# EAGLE schematic magnetov1 (EAGLE 9.1.0)
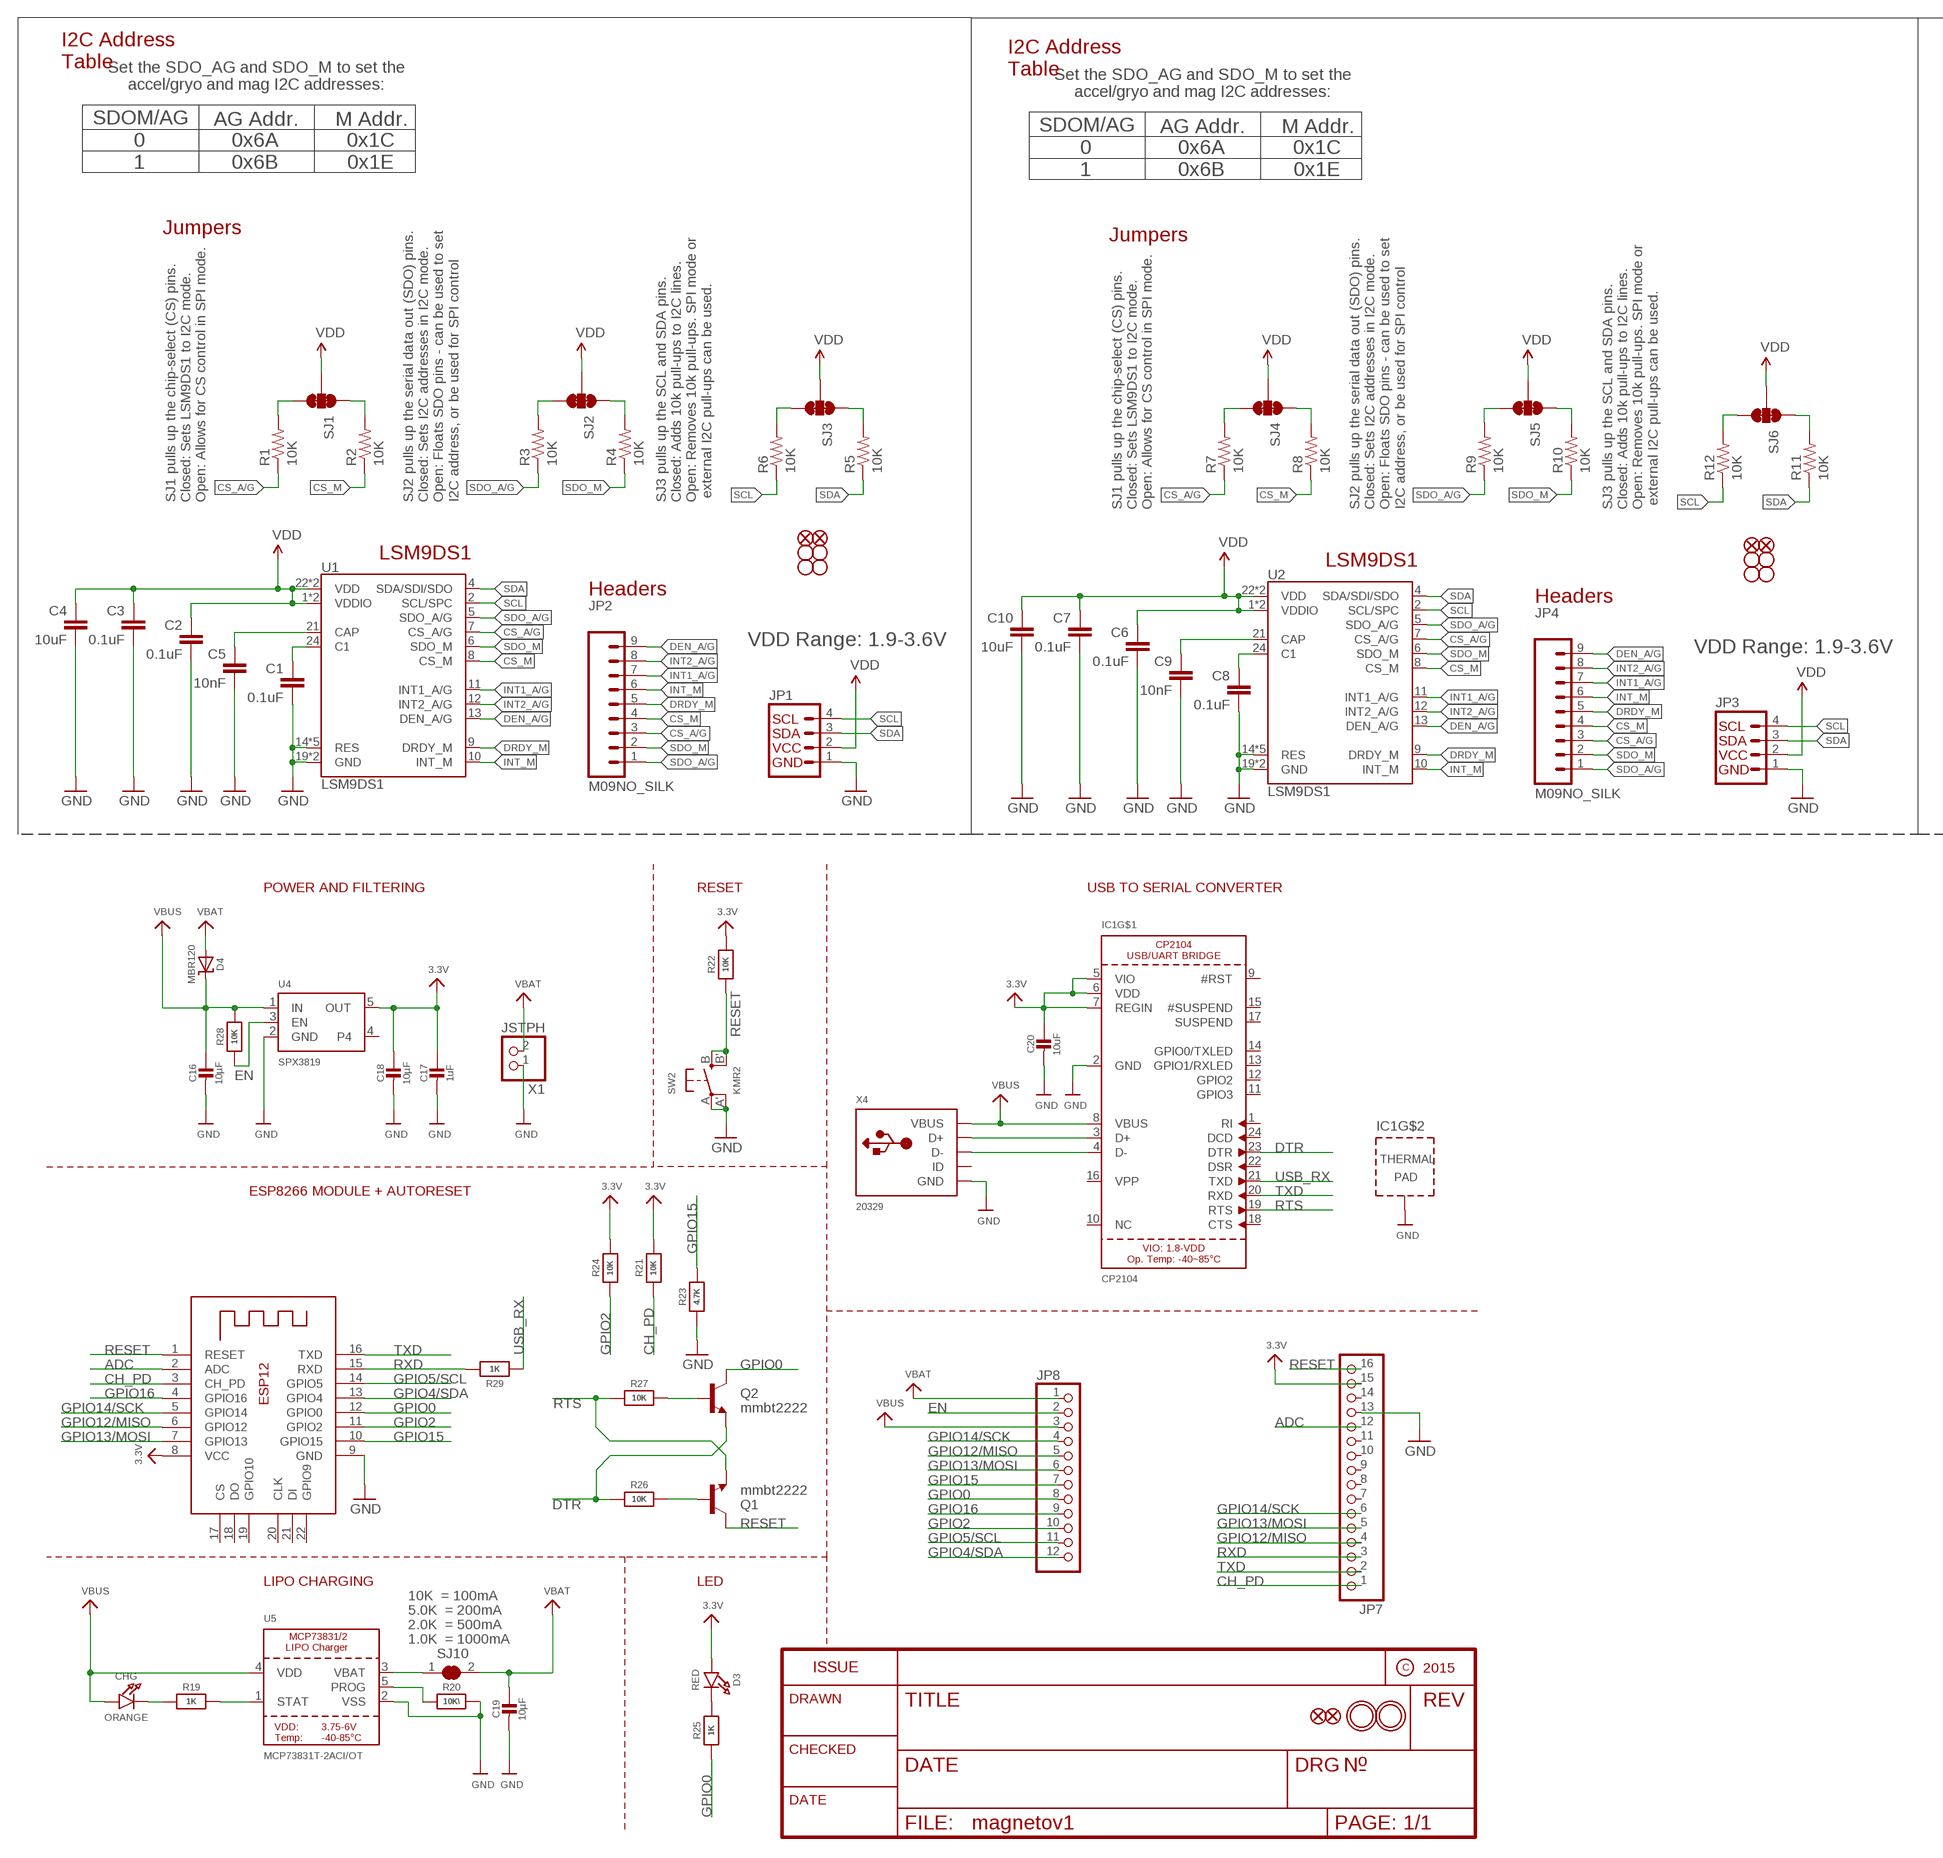
[diagram p0: schematic, sheet 1, part 1 of 2]
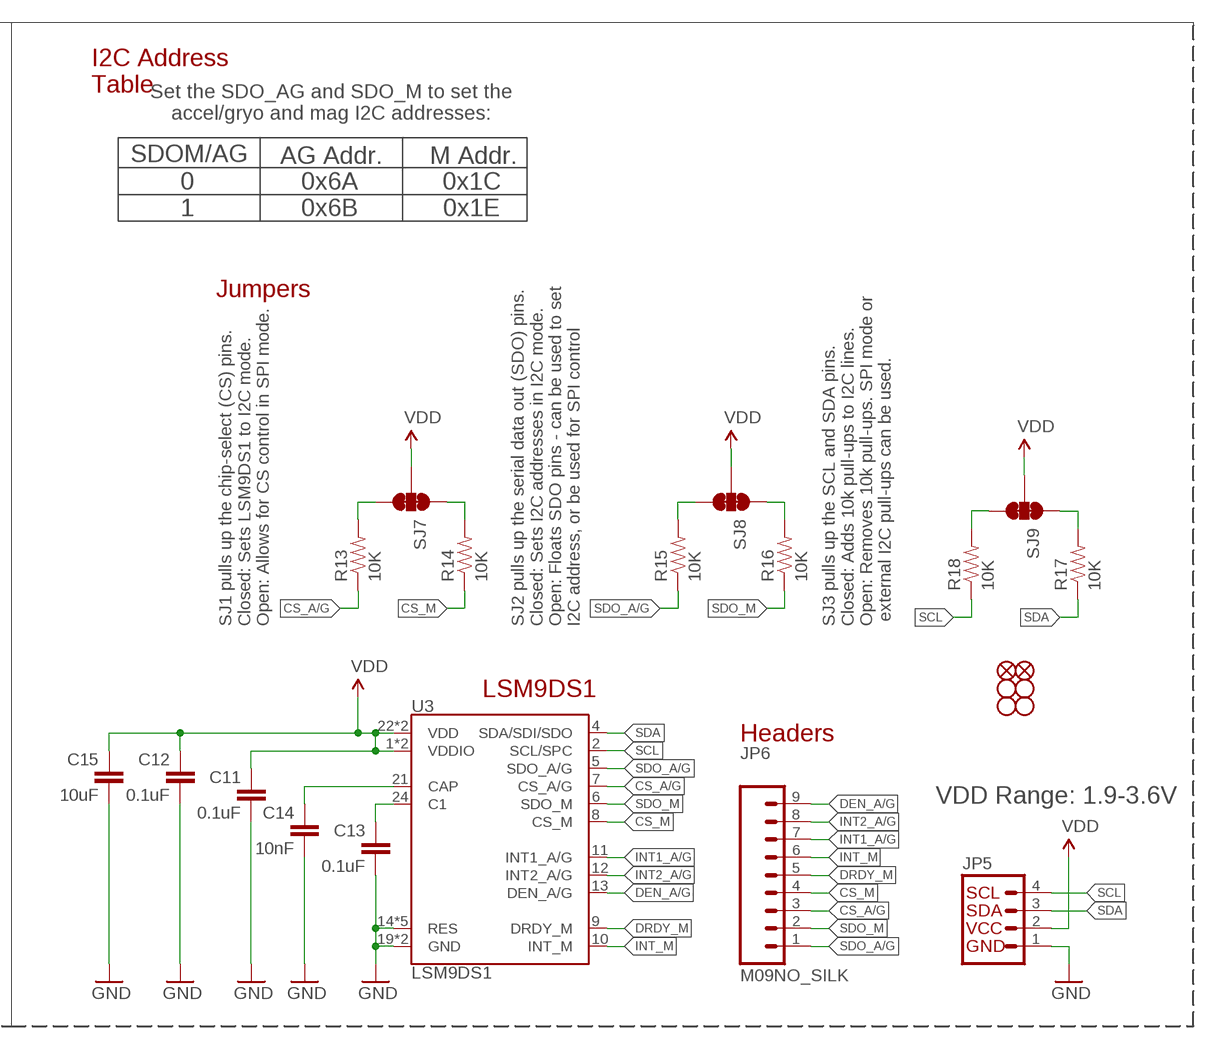
[diagram p1: schematic, sheet 1, part 2 of 2]

## Parts
C1  0.1uF  0.1UF-25V(+80/-20%)(0603)  [0603-CAP]
C2  0.1uF  0.1UF-25V(+80/-20%)(0603)  [0603-CAP]
C3  0.1uF  0.1UF-25V(+80/-20%)(0603)  [0603-CAP]
C4  10uF  10UF-6.3V-20%(0603)  [0603-CAP]
C5  10nF  10NF/10000PF-50V-10%(0603)  [0603-CAP]
C6  0.1uF  0.1UF-25V(+80/-20%)(0603)  [0603-CAP]
C7  0.1uF  0.1UF-25V(+80/-20%)(0603)  [0603-CAP]
C8  0.1uF  0.1UF-25V(+80/-20%)(0603)  [0603-CAP]
C9  10nF  10NF/10000PF-50V-10%(0603)  [0603-CAP]
C10  10uF  10UF-6.3V-20%(0603)  [0603-CAP]
C11  0.1uF  0.1UF-25V(+80/-20%)(0603)  [0603-CAP]
C12  0.1uF  0.1UF-25V(+80/-20%)(0603)  [0603-CAP]
C13  0.1uF  0.1UF-25V(+80/-20%)(0603)  [0603-CAP]
C14  10nF  10NF/10000PF-50V-10%(0603)  [0603-CAP]
C15  10uF  10UF-6.3V-20%(0603)  [0603-CAP]
C16  10µF  CAP_CERAMIC0805-NOOUTLINE  [0805-NO]
C17  1uF  CAP_CERAMIC0603_NO  [0603-NO]
C18  10µF  CAP_CERAMIC0805-NOOUTLINE  [0805-NO]
C19  10µF  CAP_CERAMIC0805-NOOUTLINE  [0805-NO]
C20  10uF  CAP_CERAMIC0805-NOOUTLINE  [0805-NO]
CHG  ORANGE  LED0805_NOOUTLINE  [CHIPLED_0805_NOOUTLINE]
D3  RED  LED0805_NOOUTLINE  [CHIPLED_0805_NOOUTLINE]
D4  MBR120  DIODE-SCHOTTKYSOD-123  [SOD-123]
FID1  FIDUCIAL1X2  [FIDUCIAL-1X2]
FID2  FIDUCIAL1X2  [FIDUCIAL-1X2]
FID3  FIDUCIAL1X2  [FIDUCIAL-1X2]
FID4  FIDUCIAL1X2  [FIDUCIAL-1X2]
FID5  FIDUCIAL1X2  [FIDUCIAL-1X2]
FID6  FIDUCIAL1X2  [FIDUCIAL-1X2]
IC1  CP2104  [QFN24_4MM_SMSC]
JP1  I2C_STANDARD_NO_SILK  [1X04_NO_SILK]
JP2  M09NO_SILK  [1X09_NO_SILK]
JP3  I2C_STANDARD_NO_SILK  [1X04_NO_SILK]
JP4  M09NO_SILK  [1X09_NO_SILK]
JP5  I2C_STANDARD_NO_SILK  [1X04_NO_SILK]
JP6  M09NO_SILK  [1X09_NO_SILK]
JP7  HEADER-1X16ROUND  [1X16_ROUND]
JP8  HEADER-1X12  [1X12_ROUND]
Q1  mmbt2222  TRANSISTOR_NPNSOT23-3  [SOT23-3]
Q2  mmbt2222  TRANSISTOR_NPNSOT23-3  [SOT23-3]
R1  10K  10KOHM-1/10W-1%(0603)0603  [0603-RES]
R2  10K  10KOHM-1/10W-1%(0603)0603  [0603-RES]
R3  10K  10KOHM-1/10W-1%(0603)0603  [0603-RES]
R4  10K  10KOHM-1/10W-1%(0603)0603  [0603-RES]
R5  10K  10KOHM-1/10W-1%(0603)0603  [0603-RES]
R6  10K  10KOHM-1/10W-1%(0603)0603  [0603-RES]
R7  10K  10KOHM-1/10W-1%(0603)0603  [0603-RES]
R8  10K  10KOHM-1/10W-1%(0603)0603  [0603-RES]
R9  10K  10KOHM-1/10W-1%(0603)0603  [0603-RES]
R10  10K  10KOHM-1/10W-1%(0603)0603  [0603-RES]
R11  10K  10KOHM-1/10W-1%(0603)0603  [0603-RES]
R12  10K  10KOHM-1/10W-1%(0603)0603  [0603-RES]
R13  10K  10KOHM-1/10W-1%(0603)0603  [0603-RES]
R14  10K  10KOHM-1/10W-1%(0603)0603  [0603-RES]
R15  10K  10KOHM-1/10W-1%(0603)0603  [0603-RES]
R16  10K  10KOHM-1/10W-1%(0603)0603  [0603-RES]
R17  10K  10KOHM-1/10W-1%(0603)0603  [0603-RES]
R18  10K  10KOHM-1/10W-1%(0603)0603  [0603-RES]
R19  1K  RESISTOR_0603_NOOUT  [0603-NO]
R20  10K\  RESISTOR_0603_NOOUT  [0603-NO]
R21  10K  RESISTOR_0603_NOOUT  [0603-NO]
R22  10K  RESISTOR_0603_NOOUT  [0603-NO]
R23  4.7K  RESISTOR_0603_NOOUT  [0603-NO]
R24  10K  RESISTOR_0603_NOOUT  [0603-NO]
R25  1K  RESISTOR_0603_NOOUT  [0603-NO]
R26  10K  RESISTOR_0603_NOOUT  [0603-NO]
R27  10K  RESISTOR_0603MP  [_0603MP]
R28  10K  RESISTOR_0603_NOOUT  [0603-NO]
R29  1K  RESISTOR_0603MP  [_0603MP]
SJ1  JUMPER-PAD-3-NC_BY_TRACE  [PAD-JUMPER-3-3OF3_NC_BY_TRACE_YES_SILK_FULL_BOX]
SJ2  JUMPER-PAD-3-NC_BY_TRACE  [PAD-JUMPER-3-3OF3_NC_BY_TRACE_YES_SILK_FULL_BOX]
SJ3  JUMPER-PAD-3-NC_BY_TRACE  [PAD-JUMPER-3-3OF3_NC_BY_TRACE_YES_SILK_FULL_BOX]
SJ4  JUMPER-PAD-3-NC_BY_TRACE  [PAD-JUMPER-3-3OF3_NC_BY_TRACE_YES_SILK_FULL_BOX]
SJ5  JUMPER-PAD-3-NC_BY_TRACE  [PAD-JUMPER-3-3OF3_NC_BY_TRACE_YES_SILK_FULL_BOX]
SJ6  JUMPER-PAD-3-NC_BY_TRACE  [PAD-JUMPER-3-3OF3_NC_BY_TRACE_YES_SILK_FULL_BOX]
SJ7  JUMPER-PAD-3-NC_BY_TRACE  [PAD-JUMPER-3-3OF3_NC_BY_TRACE_YES_SILK_FULL_BOX]
SJ8  JUMPER-PAD-3-NC_BY_TRACE  [PAD-JUMPER-3-3OF3_NC_BY_TRACE_YES_SILK_FULL_BOX]
SJ9  JUMPER-PAD-3-NC_BY_TRACE  [PAD-JUMPER-3-3OF3_NC_BY_TRACE_YES_SILK_FULL_BOX]
SJ10  SOLDERJUMPER_CLOSED  [SOLDERJUMPER_CLOSEDWIRE]
STANDOFF1  STAND-OFF  [STAND-OFF]
STANDOFF2  STAND-OFF  [STAND-OFF]
STANDOFF3  STAND-OFF  [STAND-OFF]
STANDOFF4  STAND-OFF  [STAND-OFF]
STANDOFF5  STAND-OFF  [STAND-OFF]
STANDOFF6  STAND-OFF  [STAND-OFF]
STANDOFF7  STAND-OFF  [STAND-OFF]
STANDOFF8  STAND-OFF  [STAND-OFF]
STANDOFF9  STAND-OFF  [STAND-OFF]
STANDOFF10  STAND-OFF  [STAND-OFF]
STANDOFF11  STAND-OFF  [STAND-OFF]
STANDOFF12  STAND-OFF  [STAND-OFF]
SW2  KMR2  SWITCH_TACT_SMT4.6X2.8  [BTN_KMR2_4.6X2.8]
U1  LSM9DS1  [LGA24-8X4]
U2  LSM9DS1  [LGA24-8X4]
U3  LSM9DS1  [LGA24-8X4]
U4  SPX3819  VREG_SOT23-5  [SOT23-5]
U5  MCP73831T-2ACI/OT  MCP73831/2  [SOT23-5]
U$31  MOUNTINGHOLE2.5  [MOUNTINGHOLE_2.5_PLATED]
U$32  MOUNTINGHOLE2.5  [MOUNTINGHOLE_2.5_PLATED]
U$34  FIDUCIAL""  [FIDUCIAL_1MM]
U$35  FIDUCIAL""  [FIDUCIAL_1MM]
X1  JSTPH  CON_JST_PH_2PIN  [JSTPH2]
X2  ESP-12  ESP-12E  [ESP-12E]
X4  20329  USB_MICRO_20329_V2  [4UCONN_20329_V2]

## Nets
3.3V: C17.1 C18.1 C20.1 D3.A IC1.5(VIO) IC1.6(VDD) IC1.7(REGIN) JP7.15 R21.2 R22.2 R24.2 U4.5(OUT) X2.8(VCC)
ADC: JP7.12 X2.2(ADC)
C1: C1.1 U1.24(C1)
C2: C8.1 U2.24(C1)
C3: C13.1 U3.24(C1)
CAP: C5.1 U1.21(CAP)
CAP1: C9.1 U2.21(CAP)
CAP2: C14.1 U3.21(CAP)
CH_PD: JP7.1 R21.1 X2.3(CH_PD)
CS_A/G: JP2.3 JP4.3 JP6.3 R1.1 R7.1 R13.1 U1.7(CS_A/G) U2.7(CS_A/G) U3.7(CS_A/G)
CS_A/G_PU: R1.2 SJ1.3
CS_A/G_PU1: R7.2 SJ4.3
CS_A/G_PU2: R13.2 SJ7.3
CS_M: JP2.4 JP4.4 JP6.4 R2.1 R8.1 R14.1 U1.8(CS_M) U2.8(CS_M) U3.8(CS_M)
CS_M_PU: R2.2 SJ1.1
CS_M_PU1: R8.2 SJ4.1
CS_M_PU2: R14.2 SJ7.1
DEN_A/G: JP2.9 JP4.9 JP6.9 U1.13(DEN_A/G) U2.13(DEN_A/G) U3.13(DEN_A/G)
DRDY_M: JP2.5 JP4.5 JP6.5 U1.9(DRDY_M) U2.9(DRDY_M) U3.9(DRDY_M)
DTR: IC1.23(DTR) Q2.2(E) R26.1
EN: JP8.2 R28.1 U4.3(EN)
GND: C1.2 C2.2 C3.2 C4.2 C5.2 C6.2 C7.2 C8.2 C9.2 C10.2 C11.2 C12.2 C13.2 C14.2 C15.2 C16.2 C17.2 C18.2 C19.2 C20.2 IC1.2(GND) IC1.THERM(TP) JP1.1 JP3.1 JP5.1 JP7.13 R20.2 R23.1 SW2.A'(P1) SW2.A(P) U1.14(RES) U1.15(RES) U1.16(RES) U1.17(RES) U1.18(RES) U1.19(GND) U1.20(GND) U2.14(RES) U2.15(RES) U2.16(RES) U2.17(RES) U2.18(RES) U2.19(GND) U2.20(GND) U3.14(RES) U3.15(RES) U3.16(RES) U3.17(RES) U3.18(RES) U3.19(GND) U3.20(GND) U4.2(GND) U5.2(VSS) X1.1 X2.9(GND) X4.BASE@1(GND) X4.BASE@2(GND) X4.GND X4.SPRT@1(GND) X4.SPRT@2(GND) X4.SPRT@3(GND) X4.SPRT@4(GND)
GPIO0: JP8.8 Q2.3(C) R25.1 X2.12(GPIO0)
GPIO2: JP8.10 R24.1 X2.11(GPIO2)
GPIO4/SDA: JP8.12 X2.13(GPIO4)
GPIO5/SCL: JP8.11 X2.14(GPIO5)
GPIO12/MISO: JP7.4 JP8.5 X2.6(GPIO12)
GPIO13/MOSI: JP7.5 JP8.6 X2.7(GPIO13)
GPIO14/SCK: JP7.6 JP8.4 X2.5(GPIO14)
GPIO15: JP8.7 R23.2 X2.10(GPIO15)
GPIO16: JP8.9 X2.4(GPIO16)
INT1_A/G: JP2.7 JP4.7 JP6.7 U1.11(INT1_A/G) U2.11(INT1_A/G) U3.11(INT1_A/G)
INT2_A/G: JP2.8 JP4.8 JP6.8 U1.12(INT2_A/G) U2.12(INT2_A/G) U3.12(INT2_A/G)
INT_M: JP2.6 JP4.6 JP6.6 U1.10(INT_M) U2.10(INT_M) U3.10(INT_M)
N$1: CHG.C R19.1
N$2: IC1.3(D+) X4.D+
N$3: R19.2 U5.1(STAT)
N$4: R20.1 U5.5(PROG)
N$5: D3.C R25.2
N$6: IC1.4(D-) X4.D-
N$7: SJ10.1 U5.3(VBAT)
N$12: Q1.1(B) R26.2
N$13: Q2.1(B) R27.2
RESET: JP7.16 Q1.3(C) R22.1 SW2.B'(S1) SW2.B(S) X2.1(RESET)
RTS: IC1.19(RTS) Q1.2(E) R27.1
RXD: JP7.3 R29.2 X2.15(RXD)
SCL: JP1.4 JP3.4 JP5.4 R6.1 R12.1 R18.1 U1.2(SCL/SPC) U2.2(SCL/SPC) U3.2(SCL/SPC)
SCL_PU: R6.2 SJ3.3
SCL_PU1: R12.2 SJ6.3
SCL_PU2: R18.2 SJ9.3
SDA: JP1.3 JP3.3 JP5.3 R5.1 R11.1 R17.1 U1.4(SDA/SDI/SDO) U2.4(SDA/SDI/SDO) U3.4(SDA/SDI/SDO)
SDA_PU: R5.2 SJ3.1
SDA_PU1: R11.2 SJ6.1
SDA_PU2: R17.2 SJ9.1
SDO_A/G: JP2.1 JP4.1 JP6.1 R3.1 R9.1 R15.1 U1.5(SDO_A/G) U2.5(SDO_A/G) U3.5(SDO_A/G)
SDO_A/G_PU: R3.2 SJ2.3
SDO_A/G_PU1: R9.2 SJ5.3
SDO_A/G_PU2: R15.2 SJ8.3
SDO_M: JP2.2 JP4.2 JP6.2 R4.1 R10.1 R16.1 U1.6(SDO_M) U2.6(SDO_M) U3.6(SDO_M)
SDO_M_PU: R4.2 SJ2.1
SDO_M_PU1: R10.2 SJ5.1
SDO_M_PU2: R16.2 SJ8.1
TXD: IC1.20(RXD) JP7.2 X2.16(TXD)
USB_RX: IC1.21(TXD) R29.1
VBAT: C19.1 D4.A JP8.1 SJ10.2 X1.2
VBUS: C16.1 CHG.A D4.C IC1.8(VBUS) JP8.3 R28.2 U4.1(IN) U5.4(VDD) X4.VBUS
VDD: C2.1 C3.1 C4.1 C6.1 C7.1 C10.1 C11.1 C12.1 C15.1 JP1.2 JP3.2 JP5.2 SJ1.2 SJ2.2 SJ3.2 SJ4.2 SJ5.2 SJ6.2 SJ7.2 SJ8.2 SJ9.2 U1.1(VDDIO) U1.3(VDDIO) U1.22(VDD) U1.23(VDD) U2.1(VDDIO) U2.3(VDDIO) U2.22(VDD) U2.23(VDD) U3.1(VDDIO) U3.3(VDDIO) U3.22(VDD) U3.23(VDD)
Unconnected: IC1.1(RI) IC1.9(#RST) IC1.10(NC) IC1.11(GPIO3) IC1.12(GPIO2) IC1.13(GPIO1/RXLED) IC1.14(GPIO0/TXLED) IC1.15(#SUSPEND) IC1.16(VPP) IC1.17(SUSPEND) IC1.18(CTS) IC1.22(DSR) IC1.24(DCD) JP7.7 JP7.8 JP7.9 JP7.10 JP7.11 JP7.14 U4.4 X2.17(CS) X2.18(DO) X2.19(GPIO10) X2.20(CLK) X2.21(DI) X2.22(GPIO9) X4.ID

## Notes on the sheet
- I2C Address
  Table
- Set the SDO_AG and SDO_M to set the
  accel/gryo and mag I2C addresses:
- I2C Address
  Table
- I2C Address
  Table
- Set the SDO_AG and SDO_M to set the
  accel/gryo and mag I2C addresses:
- Set the SDO_AG and SDO_M to set the
  accel/gryo and mag I2C addresses:
- SDOM/AG | AG Addr. | M Addr.
- SDOM/AG | AG Addr. | M Addr. | SDOM/AG | AG Addr. | M Addr.
- 0
  1
- 0x6A
  0x6B
- 0x1C
  0x1E
- 0
  1
- 0x6A
  0x6B
- 0x1C
  0x1E
- 0
  1
- 0x6A
  0x6B
- 0x1C
  0x1E
- Jumpers
- Jumpers | Jumpers
- SJ1 pulls up the chip-select (CS) pins.
  Closed: Sets LSM9DS1 to I2C mode.
  Open: Allows for CS control in SPI mode.
- SJ2 pulls up the serial data out (SDO) pins.
  Closed: Sets I2C addresses in I2C mode.
  Open: Floats SDO pins - can be used to set
  I2C address, or be used for SPI control
- SJ3 pulls up the SCL and SDA pins.
  Closed: Adds 10k pull-ups to I2C lines.
  Open: Removes 10k pull-ups. SPI mode or
   external I2C pull-ups can be used.
- SJ1 pulls up the chip-select (CS) pins.
  Closed: Sets LSM9DS1 to I2C mode.
  Open: Allows for CS control in SPI mode.
- SJ2 pulls up the serial data out (SDO) pins.
  Closed: Sets I2C addresses in I2C mode.
  Open: Floats SDO pins - can be used to set
  I2C address, or be used for SPI control
- SJ3 pulls up the SCL and SDA pins.
  Closed: Adds 10k pull-ups to I2C lines.
  Open: Removes 10k pull-ups. SPI mode or
   external I2C pull-ups can be used.
- SJ1 pulls up the chip-select (CS) pins.
  Closed: Sets LSM9DS1 to I2C mode.
  Open: Allows for CS control in SPI mode.
- SJ2 pulls up the serial data out (SDO) pins.
  Closed: Sets I2C addresses in I2C mode.
  Open: Floats SDO pins - can be used to set
  I2C address, or be used for SPI control
- SJ3 pulls up the SCL and SDA pins.
  Closed: Adds 10k pull-ups to I2C lines.
  Open: Removes 10k pull-ups. SPI mode or
   external I2C pull-ups can be used.
- LSM9DS1
- LSM9DS1 | LSM9DS1
- Headers
- Headers | Headers
- VDD Range: 1.9-3.6V
- VDD Range: 1.9-3.6V | VDD Range: 1.9-3.6V
- POWER AND FILTERING | RESET | USB TO SERIAL CONVERTER
- ESP8266 MODULE + AUTORESET
- LIPO CHARGING | LED
- 10K  = 100mA
- 5.0K  = 200mA
- 2.0K  = 500mA
- 1.0K  = 1000mA

## Library data of the parts
C1-C3 C6-C8 C11-C13 = SparkFun-Capacitors:0.1UF-25V(+80/-20%)(0603): CAP-00810 Ceramic Standard decoupling cap; PROD_ID: CAP-00810
C4 C10 C15 = SparkFun-Capacitors:10UF-6.3V-20%(0603): CAP-11015; PROD_ID: CAP-11015
C5 C9 C14 = SparkFun-Capacitors:10NF/10000PF-50V-10%(0603): CAP-00867; PROD_ID: CAP-00867
C16-C20 = microbuilder:CAP_CERAMIC: Ceramic Capacitors For new designs, use the packages preceded by an '_' character since they are more reliable: The following footprints should be used on most boards: _0402 - Standard footprint for regular board layouts _0603 - Standard footprint for regular board layouts _0805 - Standard footprint for regular board layouts _1206 - Standard footprint for regular board layouts For extremely tight-pitch boards where space is at a premium, the following 'micro-pitch' footprints can be used (smaller pads, no silkscreen outline, etc.): _0402MP - Micro-pitch footprint for very dense/compact boards _0603MP - Micro-pitch footprint for very dense/compact boards _0805MP - Micro-pitch footprint for very dense/compact boards _1206MP - Micro-pitch footprint for very dense/compact boards
CHG D3 = microbuilder:LED: LED 0603 - 0603 Surface Mount Package 2mA: Green LED - Low Power (3.9mcd, 2ma, 1.7Vf) - Digikey: 475-2709-2-ND Orange LED - Low Power (9.8mcd, 2ma, 1.8Vf) - Digikey: 475-1194-2-ND Red LED - Low Power (5mcd, 2ma, 1.8Vf) - Digikey: 475-1195-2-ND Yellow LED - Low Power (7mcd, 2ma, 1.8Vf) - Digikey: 475-1196-2-ND 5mA: Blue LED - Low Power (17mcd, 5ma, 2.9Vf) - Digikey: LNJ937W8CRACT-ND 0805 - 0805 Surface Mount Package 2mA: Red LED (8.8mcd, 2mA, 1.8Vf, Clear) - Low Power [Digikey: 475-2510-1-ND] Green LED (5mcd, 2mA, 1.8Vf, Clear) - Low Power [Digikey: 475-2730-1-ND] Yellow LED (11.3mcd, 2mA, 1.8Vf, Clear) - Low Power [Digikey: 475-2555-1-ND] 20mA: Red LED (104mcd, 20mA, Diffused) - LS R976 [Digikey: 475-1278-6-ND] Red LED (12mcd, 20mA, 2.0Vf, Clear) - APT2012EC [Digikey: 754-1128-1-ND] Green LED (15mcd, 20mA, 2.2Vf, Clear) - APT2012GC [Digikey: 754-1131-1-ND] Orange LED (160mcd, 20mA, 2.1Vf, Clear) - APT2012SECK [Digikey: 754-1130-1-ND] 1206 - 1206 Surface Mount Package Green LED (26mcd, 20mA, Diffused) - LG N971 [Digikey: 475-1407-6-ND] Red LED (15mcd, 20mA, Diffused) - LH N974 [Digikey: 475-1416-6-ND] Cree - Cree High-Power Surface Mount LEDs XPEBWT-L1-0000-00D50 - White 111lm 350mA 2.9Vf 6200K 110° XTEAWT-00-0000-00000LEE3 - White 114lm 350mA 2.85Vf 5000K 115° Everlight - Everlight 45-21 Series Surface Mount LEDs 45-21/QK2C-B2832AC2CB2/2T - Warm White 2000mcd 20mA 3.25Vf 3050K 120° 45-21/LK2C-B38452C4CB2/2T - Nuetral White 2000mcd 20mA 3.25Vf 4150K 120° 45-21/LK2C-B50634C6CB2/2T - Cold White 2200mcd 20mA 3.25Vf 5650K 120° PLCC2 Reverse Mount LS T77K-J1L2-1-0-2-R18-Z - Red 11.25mcd 2mA 1.8Vf 630nm 120° LO T77K-L1M2-24-Z - Orange 19.6mcd 2mA 1.8Vf 606nm 120° LY T77K-K2M1-26-Z - Yellow 15.7mcd 2mA 1.8Vf 587nm 120°
D4 = microbuilder:DIODE-SCHOTTKY
FID1-FID6 = SparkFun-Aesthetics:FIDUCIAL: Fiducial Alignment Points Various fiducial points for machine vision alignment.
IC1 = microbuilder:CP2104: CP2104 - USB to UART Bridge VDD Output: 3.45V
JP1 JP3 JP5 = SparkFun-Connectors:I2C_STANDARD: SparkFun has standardized on a pinout for all I2C based sensor breakouts. This pinout allows I2C boards to be plugged directly into the headers on Arduino Uno compatible boards, and to be daisy chained easily.
JP2 JP4 JP6 = SparkFun-Connectors:M09: Header 9 Standard 9-pin 0.1" header. Use with straight break away headers (SKU : PRT-00116), right angle break away headers (PRT-00553), swiss pins (PRT-00743), machine pins (PRT-00117), and female headers (PRT-00115).
JP7 = microbuilder:HEADER-1X16: PIN HEADER
JP8 = microbuilder:HEADER-1X12
Q1 Q2 = SparkFun:TRANSISTOR_NPN: Transistor NPN BJT configuration in SOT23 package. MMBT2222 is the common NPN we use. Double check BCE configuration again layout.
R1-R18 = SparkFun-Resistors:10KOHM-1/10W-1%(0603): RES-00824; PROD_ID: RES-00824
R19-R29 = microbuilder:RESISTOR: Resistors For new designs, use the packages preceded by an '_' character since they are more reliable: The following footprints should be used on most boards: _0402 - Standard footprint for regular board layouts _0603 - Standard footprint for regular board layouts _0805 - Standard footprint for regular board layouts _1206 - Standard footprint for regular board layouts For extremely tight-pitch boards where space is at a premium, the following 'micro-pitch' footprints can be used (smaller pads, no silkscreen outline, etc.): _0402MP - Micro-pitch footprint for very dense/compact boards _0603MP - Micro-pitch footprint for very dense/compact boards _0805MP - Micro-pitch footprint for very dense/compact boards _1206MP - Micro-pitch footprint for very dense/compact boards
SJ1-SJ9 = SparkFun-Passives:JUMPER-PAD-3-NC_BY_TRACE
SJ10 = microbuilder:SOLDERJUMPER_CLOSED: Solder Jumper - Closed These solder jumpers are closed by default CLOSEDWIRE - 10 mil trace between pads that can be cut and resoldered later CLOSEDPERM - 63 mil trace between pads for a permanent connection (used to 'bridge' two signals, a shameless hack for Eagle). Can double as a test point as well (no cream layer)
STANDOFF1-STANDOFF12 = SparkFun-Electromechanical:STAND-OFF: #4 Stand Off This is the mechanical footprint for a #4 phillips button head screw. Use the keepout ring to avoid running the screw head into surrounding components. SKU : PRT-00447
SW2 = microbuilder:SWITCH_TACT_SMT: SMT Tact Switches 6x6mm - Digikey: P12940SCT-ND KMR2 (4.6x2.8mm) - Digikey: 401-1426-1-ND EVQ-PQHB55 - Light Touch, 160GF (4.5x4.5mm) - Digikey: P8090SCT-ND KMT0 - KMT021 NGJ LHS (etc.) IP68/Waterproof - Digikey: CKN10289CT-ND
U1-U3 = LSM9DS1_temp:LSM9DS1: LSM9DS1 3D accelerometer, gyroscope & magnetometer The LSM9DS1 is a system-in-package featuring a 3D digital linear acceleration sensor, a 3D digital angular rate sensor, and a 3D digital magnetic sensor. The LSM9DS1 has a linear acceleration full scale of ±2g/±4g/±8/±16 g, a magnetic field full scale of ±4/±8/±12/±16 gauss and an angular rate of ±245/±500/±2000 dps. The LSM9DS1 includes an I2 C serial bus interface supporting standard and fast mode (100 kHz and 400 kHz) and an SPI serial standard interface. Magnetic, accelerometer and gyroscope sensing can be enabled or set in power-down mode separately for smart power management. The LSM9DS1 is available in a plastic land grid array package (LGA) and it is guaranteed to operate over an extended temperature range from -40 °C to +85 °C.; PROD_ID: IC-12536
U4 = microbuilder:VREG_SOT23-5: SOT23-5 Fixed Voltage Regulators Part Current Out V Out V In V Dropout θJA (°C/W) TJ (°C) Digikey Part No. ADP121 150mA 3.3V 3.4-5.5V 0.09V @ 150mA -- -- ADP121-AUJZ33R7CT-ND ADP121 150mA 3.0V 3.1-5.5V 0.09V @ 150mA -- -- ADP121-AUJZ30R7CT-ND ADP122 300mA 3.3V 3.4-5.5V 0.085V @ 300mA -- -- ADP122AUJZ-3.3-R7CT-ND ADP1712 300mA 3.3V 3.5-5.5V 0.17V @ 300mA -- -- ADP1712AUJZ-3.3-R7TR-ND AP7311 (Low Cost) 150mA 3.3V 3.5-6V 0.15V @ 150mA -- -- AP7311-33WG-7DICT-ND LD39015M18R 150mA 1.8V 1.9V-5.5V 0.08V @ 100mA -- -- 497-6977-1-ND LP2985A-33DBVR 150mA 3.3V 3.3-16V 0.28V @ 150mA 206 150 296-18479-1-ND MCP1824T-3302E/OT 300mA 3.3V 3.5V-6V 0.2V @ 300mA -- -- MCP1824T-3302E/OTCT-ND MIC5205-2.5YM5 TR 150mA 2.5V 2.7-16V 0.165V @ 150mA -- -- 576-1257-2-ND MIC5205-3.0YM5 TR 150mA 3.0V 3.2V-16V 0.165V @ 150mA -- -- 576-1258-2-ND MIC5205-3.3YM5 TR 150mA 3.3V 3.5V-16V 0.165V @ 150mA -- -- 576-1259-2-ND TPS780330220 150mA 3.3V+2.2V 3.6-5.5V 250mV Max -- -- 296-23332-1-ND TDA3663/N1,135 100mA 3.3V 3.5-45V 0.18V @ 50mA -- -- 568-5343-1-ND Max operating temp can be calculated using θJA, TJ (max junction temperature), and power in watts. Set the "Maximum Ambient Temperature" until it reaches TJ ("Max Junction Temperature"), which is the absolute limit for safe use of the regulator: Heat Sink Temperature Calculator <http://www.daycounter.com/Calculators/Heat-Sink-Temperature-Calculator.phtml> For example, With 12V source into a 3.3V LP2985 and a 30mA load, we are dissipating (12V-3.3V) * 0.03A = 0.261W. With a θJA of 206 °C/W, a TJ of 150°C, and 261mW we can safely use the chip without a heat sink up to 75°C (=147.1°C Junction Temperature).
U5 = microbuilder:MCP73831/2: MCP73831/2 LIPO Charger VDD: 3.75 - 6V Temp -40 - 85°C Programmable Charge Rate: 15-500mA NOTE: STAT is a tri-state logic output on the MCP73831 and an open-drain output on the MCP73832. SOT23-5 with 4.2V output and tri-state logic on STAT = MCP73831T-2ACI/OT
U$31 U$32 = microbuilder:MOUNTINGHOLE: Mounting Hole For #2 screws (0.086"/2.18mm width, 0.094"/2.4mm hole) use 2.5mm; BOM: EXCLUDE
U$34 U$35 = microbuilder:FIDUCIAL: Fiducial Alignment Points Various fiducial points for machine vision alignment.; BOM: EXCLUDE
X1 = microbuilder:CON_JST_PH_2PIN: JST 2-Pin Right-Angle Connector PH-Series - 4UConnector: 17311 SH-Series - 4UConnector: 07278
X2 = microbuilder:ESP-12E
X4 = microbuilder:USB: USB Connectors USBMINIB - Surface Mount Female Mini-B USB Connector 4UConnector: 06564